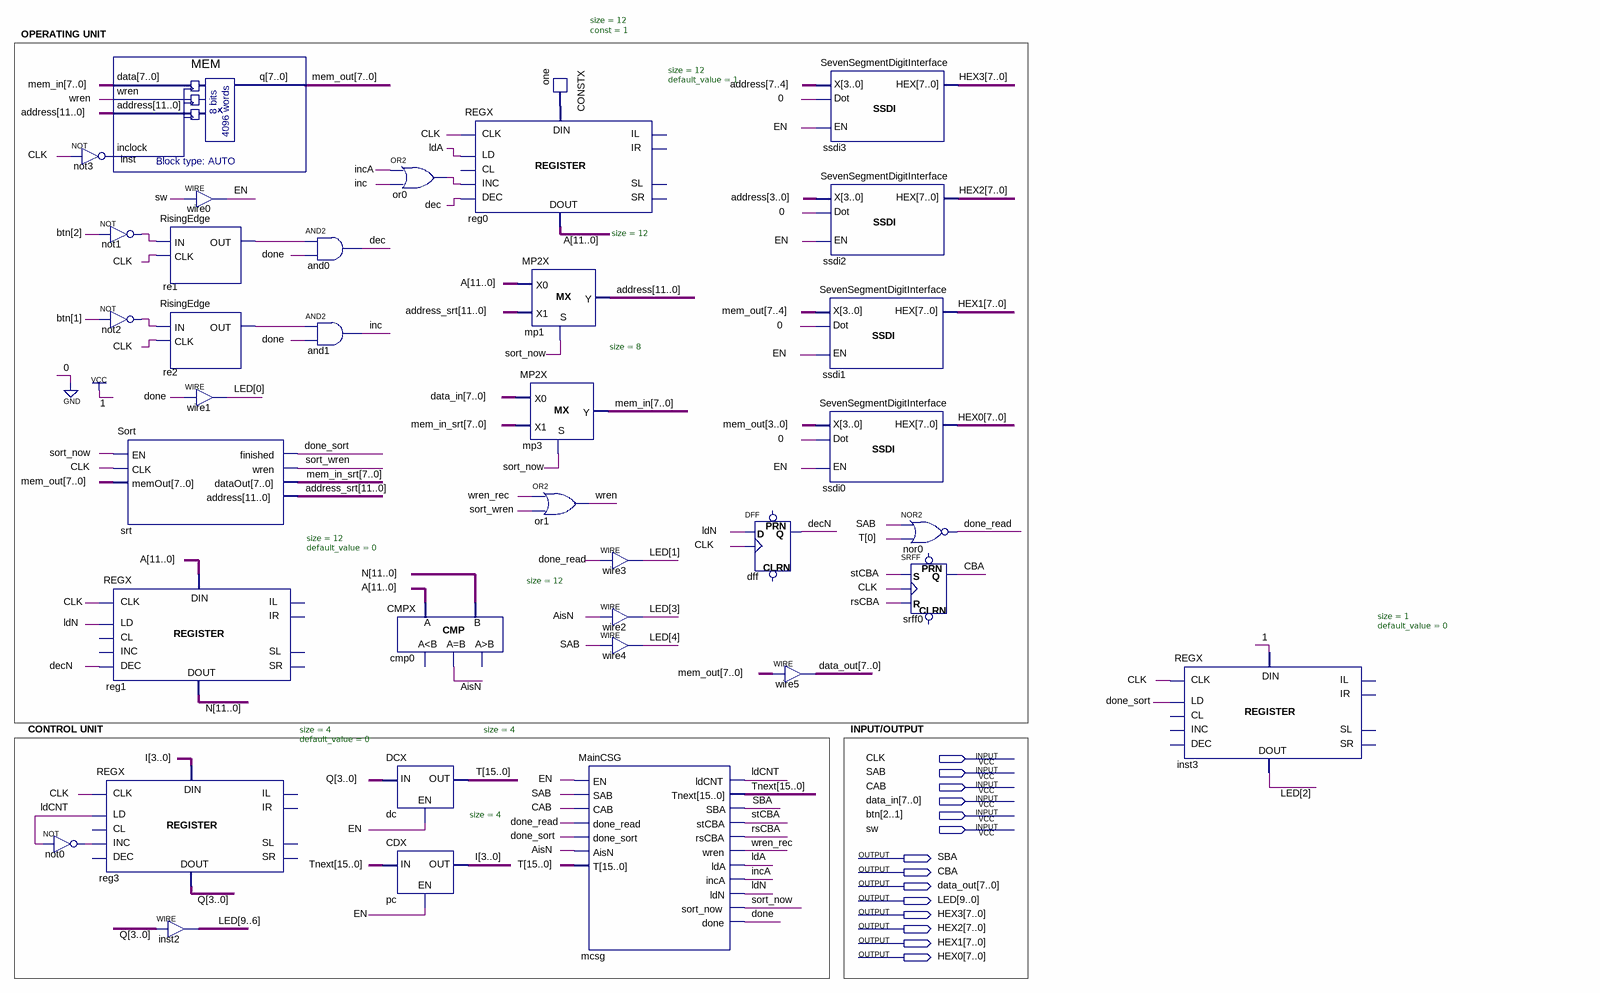
[diagram p0: schematic sheet]
// Quartus schematic ParallelSortWorker.bdf as structural Verilog: 37 symbols, 14 pins
module ParallelSortWorker (
  input  CLK,
  input  SAB,
  input  CAB,
  input  [7:0] data_in,
  input  [2:1] btn,
  input  sw,
  output SBA,
  output CBA,
  output [7:0] data_out,
  output [9:0] LED,
  output [7:0] HEX3,
  output [7:0] HEX2,
  output [7:0] HEX1,
  output [7:0] HEX0
);

  wire AisN, dec, decN, done, done_read, done_sort, EN, inc, incA, ldA, ldCNT, ldN, not0_out, not1_out,
       not2_out, not3_out, or0_out, re1_out, re2_out, rsCBA, sort_now, sort_wren, stCBA, wren, wren_rec;
  wire [3:0] I, Q;
  wire [7:0] mem_in, mem_in_srt, mem_out;
  wire [11:0] A, address, address_srt, N, one_data;
  wire [15:0] T, Tnext;

  not not3 (not3_out, CLK);
  not not0 (not0_out, ldCNT);
  MEM inst (.data(mem_in), .wren(wren), .address(address), .inclock(not3_out), .q(mem_out));
  not not1 (not1_out, btn[2]);
  not not2 (not2_out, btn[1]);
  Sort srt (
    .EN(sort_now), .CLK(CLK), .memOut(mem_out), .finished(done_sort), .wren(sort_wren), .dataOut(mem_in_srt),
    .address(address_srt));
  REGX #(.size(12), .default_value(0)) reg1 (
    .data_in(A), .clk(CLK), .ld(ldN), .dec(decN), .data_out(N));  // open: cl, inc, il, ir, sl, sr
  REGX #(.size(4), .default_value(0)) reg3 (
    .data_in(I), .clk(CLK), .ld(ldCNT), .inc(not0_out), .data_out(Q));  // open: cl, dec, il, ir, sl, sr
  assign EN = sw;  // WIRE wire0
  RisingEdge re1 (.IN(not1_out), .CLK(CLK), .OUT(re1_out));
  RisingEdge re2 (.IN(not2_out), .CLK(CLK), .OUT(re2_out));
  assign LED[0] = done;  // WIRE wire1
  assign LED[9:6] = Q;  // WIRE inst2
  and and0 (dec, re1_out, done);
  and and1 (inc, re2_out, done);
  or or0 (or0_out, incA, inc);
  CMPX #(.size(12)) cmp0 (.A(A), .B(N), .eq(AisN));  // open: ls, gr
  DCX #(.size(4)) dc (.EN(EN), .X(Q), .Y(T));
  CDX #(.size(4)) pc (.EN(EN), .X(Tnext), .Y(I));
  REGX #(.size(12), .default_value(1)) reg0 (
    .data_in(one_data), .clk(CLK), .ld(ldA), .inc(or0_out), .dec(dec), .data_out(A));  // open: cl, il, ir, sl, sr
  MP2X #(.size(12)) mp1 (.S(sort_now), .X0(A), .X1(address_srt), .Y(address));
  MP2X #(.size(8)) mp3 (.S(sort_now), .X0(data_in), .X1(mem_in_srt), .Y(mem_in));
  CONSTX #(.size(12), .\const (1)) one (.data(one_data));
  or or1 (wren, wren_rec, sort_wren);
  MainCSG mcsg (
    .EN(EN), .SAB(SAB), .CAB(CAB), .done_read(done_read), .done_sort(done_sort), .AisN(AisN), .T(T),
    .ldCNT(ldCNT), .Tnext(Tnext), .SBA(SBA), .stCBA(stCBA), .rsCBA(rsCBA), .wren(wren_rec), .ldA(ldA),
    .incA(incA), .ldN(ldN), .sort_now(sort_now), .done(done));
  assign LED[1] = done_read;  // WIRE wire3
  assign LED[3] = AisN;  // WIRE wire2
  assign LED[4] = SAB;  // WIRE wire4
  DFF dff (.CLK(CLK), .D(ldN), .Q(decN));  // open: CLRN, PRN
  assign data_out = mem_out;  // WIRE wire5
  SevenSegmentDigitInterface ssdi3 (.x(address[7:4]), .dot(1'b0), .en(EN), .hex(HEX3));
  SevenSegmentDigitInterface ssdi2 (.x(address[3:0]), .dot(1'b0), .en(EN), .hex(HEX2));
  SevenSegmentDigitInterface ssdi1 (.x(mem_out[7:4]), .dot(1'b0), .en(EN), .hex(HEX1));
  SevenSegmentDigitInterface ssdi0 (.x(mem_out[3:0]), .dot(1'b0), .en(EN), .hex(HEX0));
  nor nor0 (done_read, SAB, T[0]);
  SRFF srff0 (.S(stCBA), .R(rsCBA), .CLK(CLK), .Q(CBA));  // open: PRN, CLRN
  REGX #(.size(1), .default_value(0)) inst3 (
    .data_in(1'b1), .clk(CLK), .ld(done_sort), .data_out(LED[2]));  // open: cl, inc, dec, il, ir, sl, sr

  // Notes on the sheet:
  //   OPERATING UNIT
  //   CONTROL UNIT
  //   INPUT/OUTPUT
endmodule
